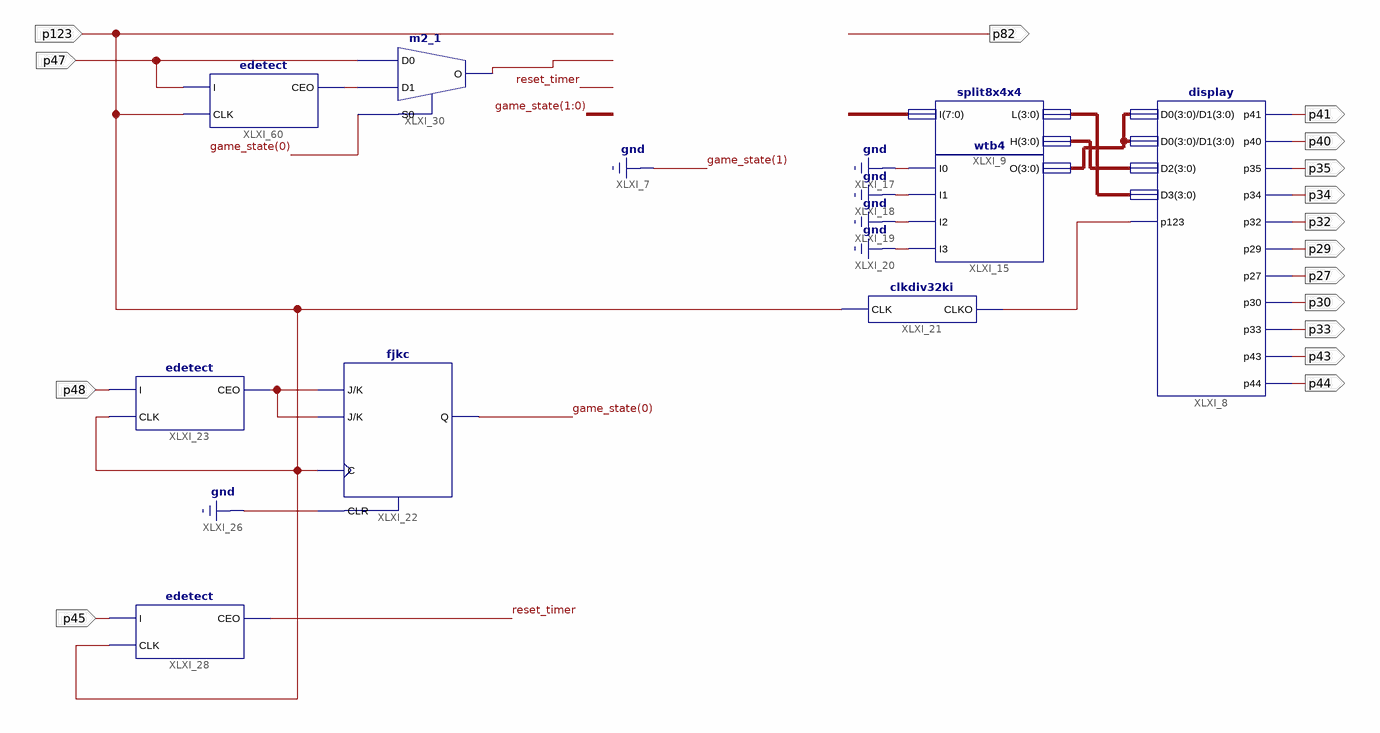
[diagram p0: schematic sheet 1]
// Xilinx ISE schematic mian.sch (spartan6) as structural Verilog: 9 symbols, 16 ports
module mian (
  input  p47,
  input  p123,
  input  p48,
  input  p45,
  output p82,
  output p41,
  output p40,
  output p35,
  output p34,
  output p32,
  output p29,
  output p27,
  output p30,
  output p33,
  output p43,
  output p44
);

  wire reset_timer, XLXN_91, XLXN_103, XLXN_187, XLXN_188;
  wire [0:0] game_state;
  wire [3:0] XLXN_97, XLXN_98, XLXN_99;
  wire [7:0] XLXN_2;

  fjkc XLXI_22 (.C(p123), .CLR(1'b0), .J(XLXN_103), .K(XLXN_103), .Q(game_state[0]));
  edetect XLXI_23 (.CEO(XLXN_103), .CLK(p123), .I(p48));
  edetect XLXI_28 (.CEO(reset_timer), .CLK(p123), .I(p45));
  m2_1 XLXI_30 (.D0(p47), .D1(XLXN_187), .S0(game_state[0]), .O(XLXN_188));
  display XLXI_8 (
    .D0(XLXN_99), .D1(XLXN_99), .D2(XLXN_98), .D3(XLXN_97), .p123(XLXN_91), .p27(p27), .p29(p29), .p30(p30),
    .p32(p32), .p33(p33), .p34(p34), .p35(p35), .p40(p40), .p41(p41), .p43(p43), .p44(p44));
  wtb4 XLXI_15 (.I0(1'b0), .I1(1'b0), .I2(1'b0), .I3(1'b0), .O(XLXN_99));
  clkdiv32ki XLXI_21 (.CLK(p123), .CLKO(XLXN_91));
  split8x4x4 XLXI_9 (.H(XLXN_98), .I(XLXN_2), .L(XLXN_97));
  edetect XLXI_60 (.CEO(XLXN_187), .CLK(p123), .I(p47));
endmodule
